# EAGLE design BQ25570 (EAGLE 7.1.0)
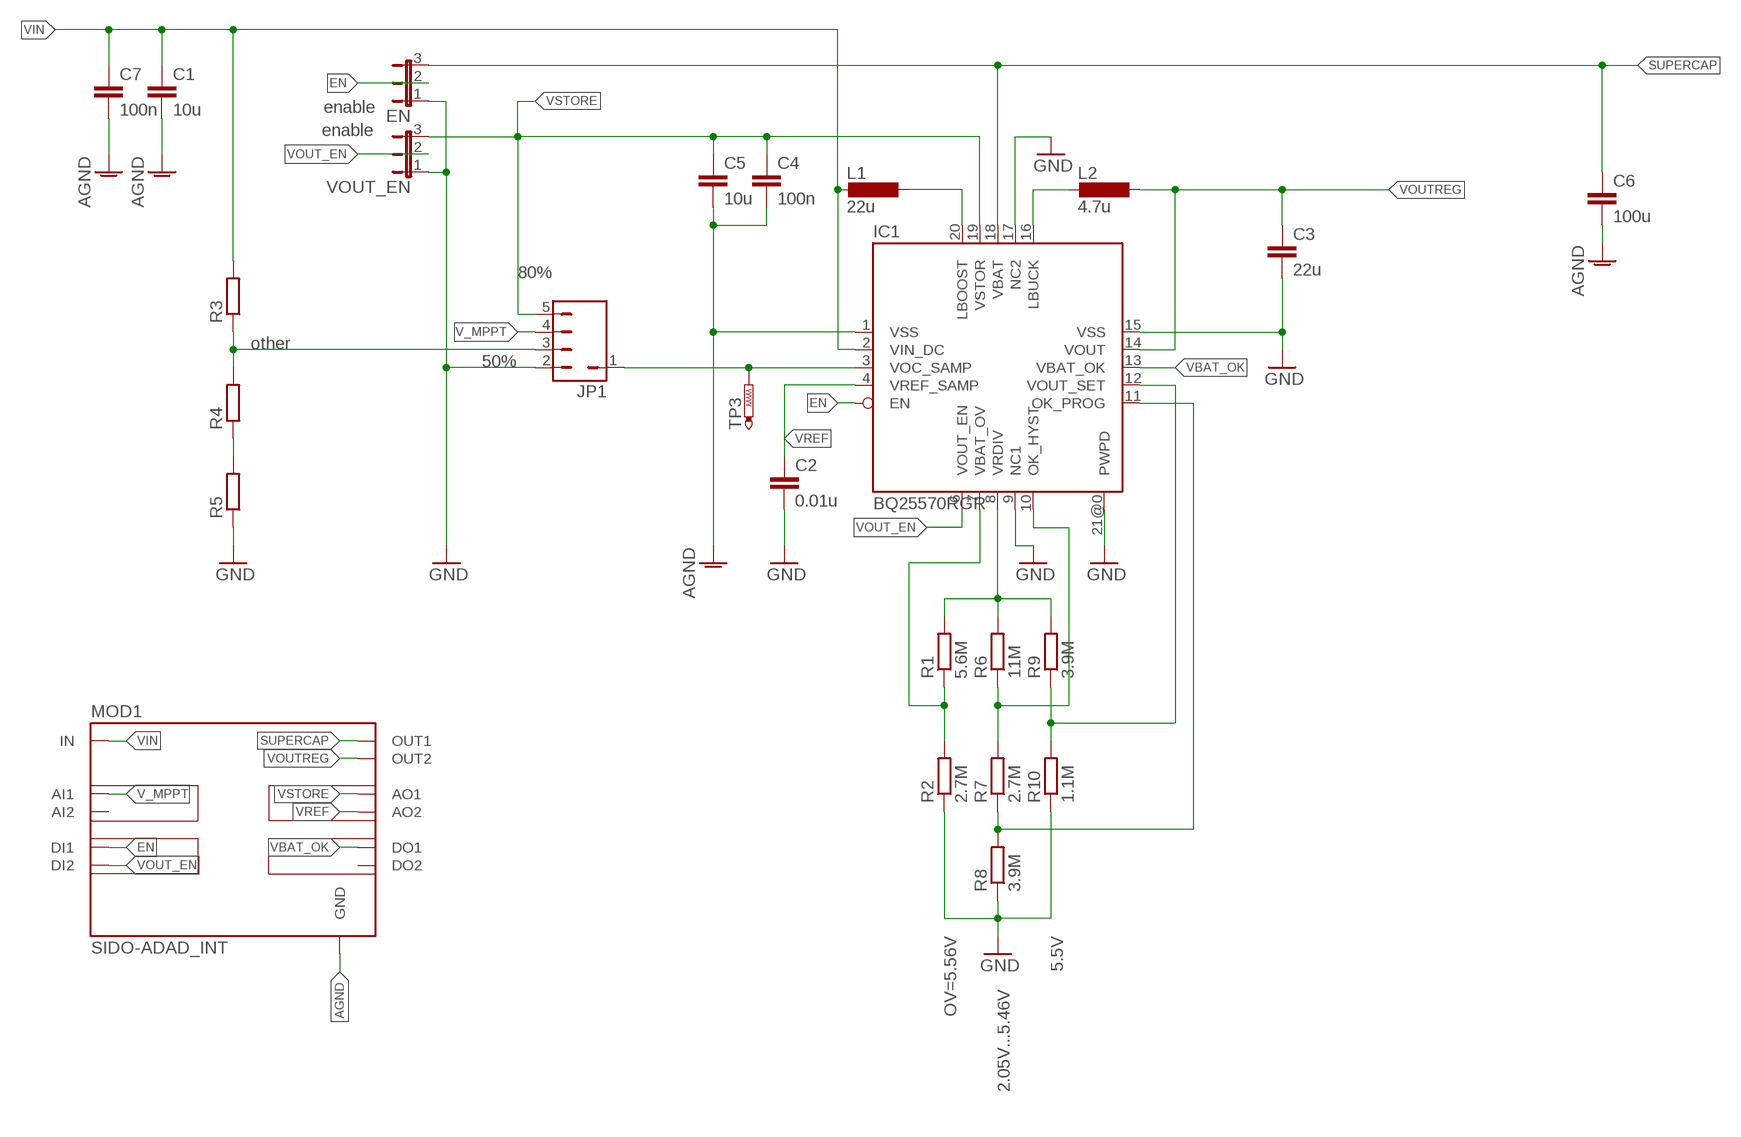
[diagram p0: schematic, sheet 1]

## Parts
C1  10u  C-EUC1206K  [C1206K]
C2  0.01u  C-EUC0805K  [C0805K]
C3  22u  C-EUC1206K  [C1206K]
C4  100n  C-EUC0805K  [C0805K]
C5  10u  C-EUC1206K  [C1206K]
C6  100u  C-EUC1206K  [C1206K]
C7  100n  C-EUC0805K  [C0805K]
EN  JP2E  [JP2]
IC1  BQ25570RGR  [QFN20]
JP1  JP3Q  [JP1-4]
L1  22u  L-EUL4035M  [L4035M]
L2  4.7u  L-EUL4035M  [L4035M]
MOD1  SIDO-ADAD_INT  [SIDO-ADAD]
R1  5.6M  R-EU_R0805  [R0805]
R2  2.7M  R-EU_R0805  [R0805]
R3  R-EU_R0805  [R0805]
R4  R-EU_R0805  [R0805]
R5  R-EU_R0805  [R0805]
R6  11M  R-EU_R0805  [R0805]
R7  2.7M  R-EU_R0805  [R0805]
R8  3.9M  R-EU_R0805  [R0805]
R9  3.9M  R-EU_R0805  [R0805]
R10  1.1M  R-EU_R0805  [R0805]
TP3  PTR1B1,27  [B1,27]
VOUT_EN  JP2E  [JP2]

## Nets
AGND: C1.2 C4.2 C5.2 C6.2 C7.2 IC1.1(VSS) MOD1.GND1(GND) MOD1.GND2(GND) MOD1.GND3(GND) MOD1.GND4(GND)
EN: EN.2 IC1.5(EN) MOD1.DI1
GND: C2.2 C3.2 EN.1 IC1.9(NC1) IC1.15(VSS) IC1.17(NC2) IC1.21@0(PWPD) JP1.2 R2.1 R5.1 R8.1 R10.1 VOUT_EN.1
N$3: JP1.3 R3.1 R4.2
N$5: IC1.7(VBAT_OV) R1.1 R2.2
N$6: IC1.3(VOC_SAMP) JP1.1 TP3.TP
N$7: IC1.16(LBUCK) L2.2
N$8: IC1.11(OK_PROG) R7.1 R8.2
N$10: IC1.10(OK_HYST) R6.1 R7.2
N$11: R4.1 R5.2
N$12: IC1.20(LBOOST) L1.1
N$13: IC1.12(VOUT_SET) R9.1 R10.2
SUPERCAP: C6.1 EN.3 IC1.18(VBAT) MOD1.OUT1_1(OUT1) MOD1.OUT1_2(OUT1) MOD1.OUT1_3(OUT1) MOD1.OUT1_4(OUT1)
V_MPPT: JP1.4 MOD1.AI1
VBAT_OK: IC1.13(VBAT_OK) MOD1.DO1
VIN: C1.1 C7.1 IC1.2(VIN_DC) L1.2 MOD1.IN1(IN) MOD1.IN2(IN) MOD1.IN3(IN) MOD1.IN4(IN) R3.2
VOUT_EN: IC1.6(VOUT_EN) MOD1.DI2 VOUT_EN.2
VOUTREG: C3.1 IC1.14(VOUT) L2.1 MOD1.OUT2_1(OUT2) MOD1.OUT2_2(OUT2) MOD1.OUT2_3(OUT2) MOD1.OUT2_4(OUT2)
VRDIV: IC1.8(VRDIV) R1.2 R6.2 R9.2
VREF: C2.1 IC1.4(VREF_SAMP) MOD1.AO2
VSTORE: C4.1 C5.1 IC1.19(VSTOR) JP1.5 MOD1.AO1 VOUT_EN.3
Unconnected: MOD1.AI2 MOD1.DO2

## Notes on the sheet
- enable
- enable
- 80%
- other
- 50%
- OV=5.56V | 5.5V
- 2.05V...5.46V

## Library data of the parts
C1-C7 = rcl:C-EU: CAPACITOR, European symbol
EN VOUT_EN = Jumper_mod:JP2E: JUMPER
IC1 = BQ25570:BQ25570: TEXAS INSTRUMENTS BQ25570 - VQFN20 http://www.ti.com/lit/ds/symlink/bq25570.pdf
JP1 = JP1-4:JP3Q: JUMPER
L1 L2 = resistor:L-EU: INDUCTOR, European symbol
MOD1 = AllModules:SIDO-ADAD_INT
R1-R10 = rcl:R-EU_: RESISTOR, European symbol
TP3 = testpad:PTR1: TEST PIN

## Board
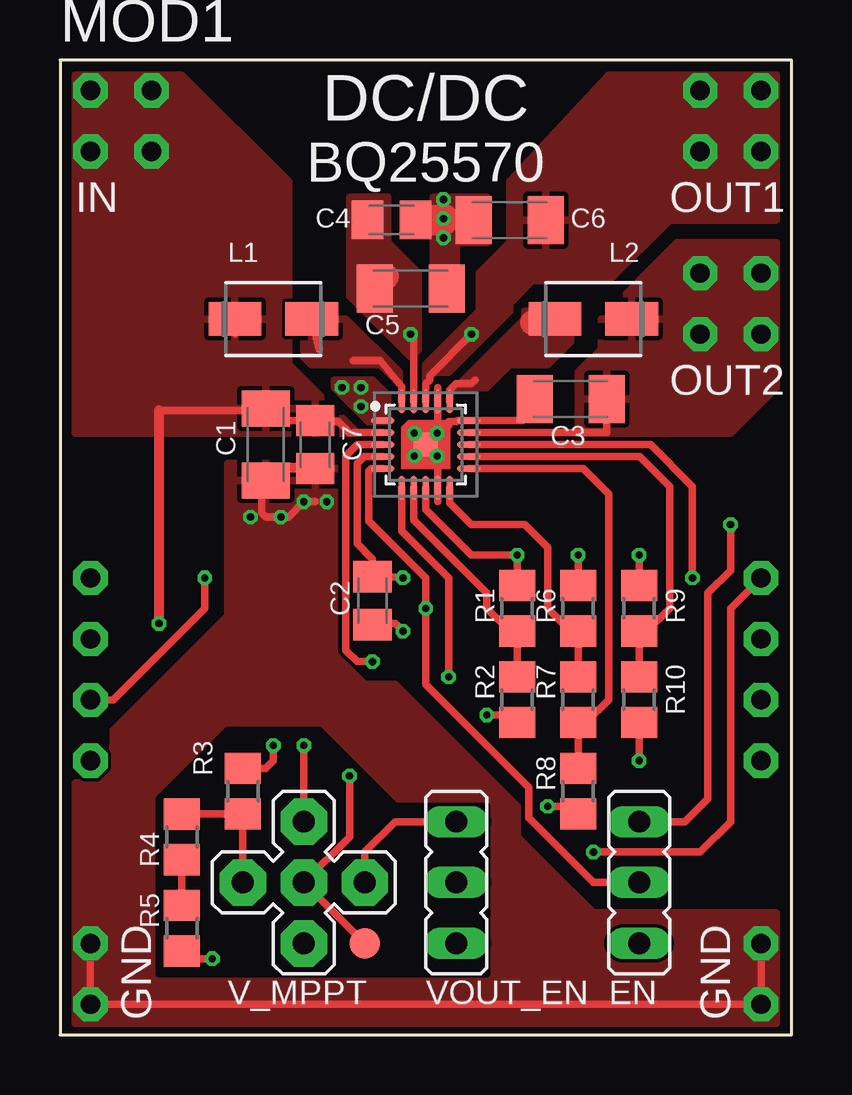
[diagram p1: board, top side]
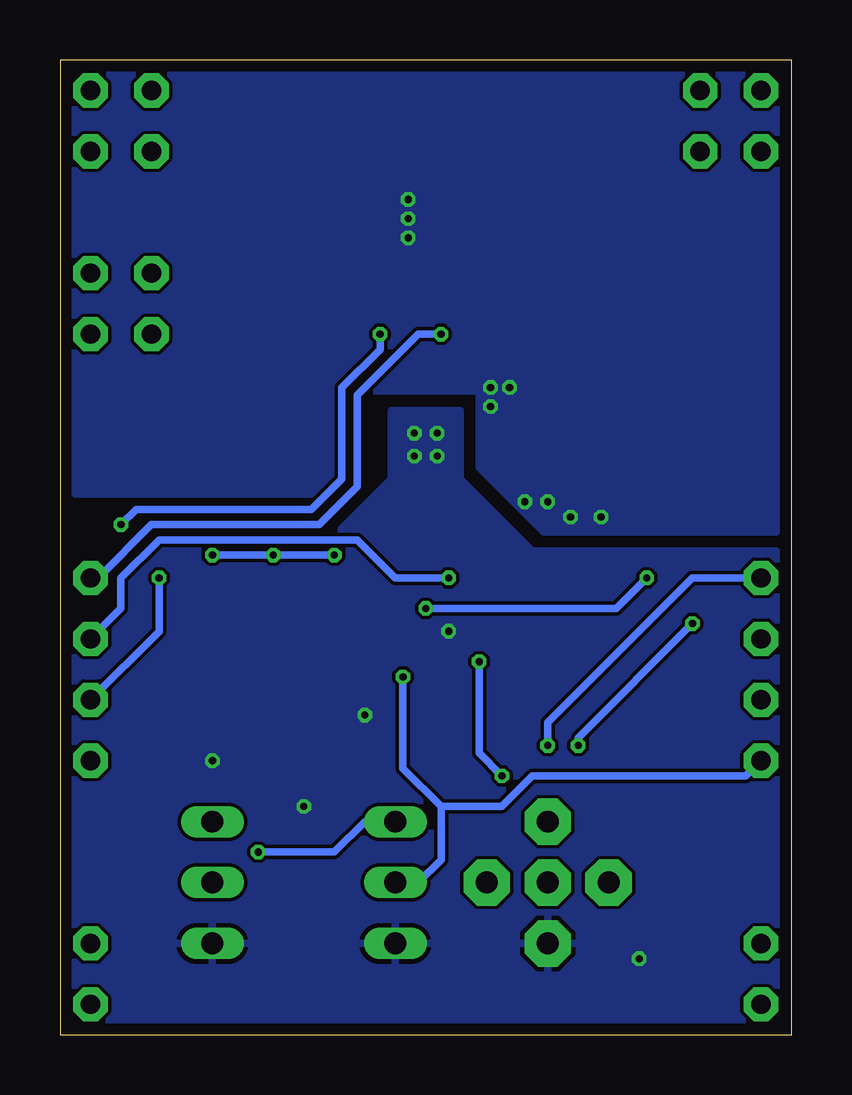
[diagram p2: board, bottom side, seen from below]

Size 30.48 x 40.64 mm. Coordinates in mm from the lower left corner, seen from the top.
Outline: 0,40.64 30.48,40.64 30.48,0 0,0 0,40.64
Copper layers (1*16): Top 0.035mm / dielectric 1.5mm / Bottom 0.035mm
Design rules "PCB-POOL Standard": minimum track width 0.15mm, minimum drill 0.3mm, track to track 0.15mm, track to pad 0.15mm, pad to pad 0.15mm, via to via 0.15mm, smd to smd 0.15mm, copper to edge 0.3mm, drill to drill 0.2mm, minimum pad ring 0.2mm, minimum via ring 0.15mm, stop-mask expansion 0.075mm, vias tented up to drill 0mil, thermal gap 0.2mm

### Footprints (pad centres in the part's own frame; a part is rotated, then mirrored left to right if it is on the bottom)
C1206K = smd 1.5 x 2: 1 -1.5,0; 2 1.5,0
C0805K = smd 1.3 x 1.6: 1 -1,0; 2 1,0
JP2 = drill 0.914 long: 1 -2.54,0; 2 0,0; 3 2.54,0
QFN20 = smd 0.28 x 1: 1 -1,-1.795; 2 -0.5,-1.795; 3 0,-1.795; 4 0.5,-1.795; 5 1,-1.795; 11 1,1.795; 12 0.5,1.795; 13 0,1.795; 14 -0.5,1.795; 15 -1,1.795 | smd 1 x 0.28: 6 1.795,-1; 7 1.795,-0.5; 8 1.795,0; 9 1.795,0.5; 10 1.795,1; 16 -1.795,1; 17 -1.795,0.5; 18 -1.795,0; 19 -1.795,-0.5; 20 -1.795,-1 | smd 1 x 1: 21@0 0,0
JP1-4 = drill 0.914 pad 1.93 octagon: 1 0,0; 2 0,2.54; 3 2.54,0; 4 0,-2.54; 5 -2.54,0
L4035M = smd 2.2 x 1.4: 1 -1.6,0; 2 1.6,0
SIDO-ADAD = drill 0.8 pad 1.422 octagon: AI1 0,-20.32; AI2 0,-22.86; AO1 27.94,-20.32; AO2 27.94,-22.86; DI1 0,-25.4; DI2 0,-27.94; DO1 27.94,-25.4; DO2 27.94,-27.94; GND1 0,-38.1; GND2 0,-35.56; GND3 27.94,-35.56; GND4 27.94,-38.1; IN1 0,0; IN2 0,-2.54; IN3 2.54,0; IN4 2.54,-2.54; OUT1_1 27.94,0; OUT1_2 27.94,-2.54; OUT1_3 25.4,0; OUT1_4 25.4,-2.54; OUT2_1 27.94,-7.62; OUT2_2 27.94,-10.16; OUT2_3 25.4,-7.62; OUT2_4 25.4,-10.16
R0805 = smd 1.3 x 1.5: 1 -0.95,0; 2 0.95,0
B1,27 = smd 1.27 x 1.27: TP 0,0

### Placement (x,y rotation side)
C1  8.57,24.61 270 top
C2  13.02,18.1 270 top
C3  21.27,26.51 180 top
C4  13.81,33.97 0 top
C5  14.61,31.12 0 top
C6  18.73,33.97 180 top
C7  10.64,24.61 270 top
EN  24.13,6.35 90 top
IC1  15.24,24.61 270 top
JP1  10.16,6.35 180 top
L1  8.89,29.84 180 top
L2  22.23,29.84 180 top
MOD1  1.27,39.37 0 top
R1  19.05,17.78 90 top
R2  19.05,13.97 90 top
R3  7.62,10.16 90 top
R4  5.08,8.26 90 top
R5  5.08,4.45 90 top
R6  21.59,17.78 90 top
R7  21.59,13.97 90 top
R8  21.59,10.16 90 top
R9  24.13,17.78 90 top
R10  24.13,13.97 90 top
TP3  12.7,3.81 0 top
VOUT_EN  16.51,6.35 90 top

### Tracks (layer width: path | path; a pad name or v marks a point on that pad's centre or on a via)
AGND  (via drill 0.3)
  Top 0.305: MOD1.GND3 MOD1.GND4 MOD1.GND1 MOD1.GND2 | C1.2 8.41,22.95 8.41,21.75 8.57,21.59 9.53,21.59 v10.16,22.23 10.64,22.23
  Top 0.406: 8.57,22.86 8.57,23.65 10.79,23.65
  Top 1.27: C4.2 15.97,33.97 v15.97,34.02
  other vias: 15.97,33.23 15.97,34.83 11.75,26.99 12.54,26.19 12.54,26.99 11.11,22.23 9.21,21.59 7.94,21.59
  pour Top: 0.64,0.48 0.64,10.48 2.22,12.07 2.22,12.7 6.99,17.46 6.99,23.81 11.43,23.81 11.43,15.88 12.7,14.61 13.97,14.61 19.05,9.53 19.05,8.26 22.23,5.08 29.84,5.08 29.84,0.48
  pour Top (no thermals): 0.64,4.76 2.22,4.76 2.22,0.48 0.64,0.48
  pour Top (no thermals): 27.94,5.08 29.84,5.08 29.84,0.48 28.1,0.48
  cutout Top (no thermals): 4.13,9.84 4.13,2.54 17.78,2.54 17.78,9.53 13.97,9.53 10.79,12.7 6.99,12.7
  pour Bottom: 0.64,40.01 0.64,20.96 10.32,20.96 13.02,23.65 13.02,26.83 18.73,26.83 18.73,23.18 19.37,22.54 29.84,22.54 29.84,40.01
  pour Top (no thermals): 15.56,30.8 15.56,34.92 17.78,34.92 17.78,33.02 16.51,33.02 16.51,30.8
  pour Top (no thermals): 11.43,26.99 11.43,27.3 13.02,27.3 13.65,26.67 13.65,25.4 13.02,25.4
EN  (via drill 0.3)
  Top 0.305: IC1.5 12.97,23.61 12.86,23.5 12.86,21.43 15.24,19.05 v15.24,17.78 15.24,14.61 19.53,10.32 19.53,9.05 22.23,6.35 EN.2 | v6.03,19.05 6.03,17.78 2.22,13.97 MOD1.DI1
  Bottom 0.305: v6.03,19.05 7.3,17.78 v15.24,17.78
GND  (via drill 0.3)
  Top 0: IC1.21@0 15.72,24.61 v15.72,25.08
  Top 0.305: C3.2 19.37,26.11 19.37,25.72 19.26,25.61 IC1.15 16.56,25.61 16.51,25.56 16.19,25.56 | 18.89,12.54 R2.1 18.73,13.34 v17.78,13.34 | 16.19,25.56 v15.72,25.08 | 15.74,25.4 IC1.9 15.74,22.23 | 15.74,25.4 IC1.17 15.74,26.99 | v24.13,11.43 R10.1 | v20.32,9.53 21.27,9.53 R8.1 | v6.35,3.17 5.4,3.17 R5.1 | v14.29,16.83 13.97,17.14 13.06,17.14 C2.2 | 16.19,25.56 16.19,25.4 15.74,25.4
  Top 0.406: 19.05,12.7 R2.1
  other vias: 14.76,25.08 14.76,24.13 15.72,24.13
  pour Bottom: 0.64,20.16 0.64,0.63 29.84,0.63 29.84,20.16
  pour Bottom (no thermals): 13.81,23.18 13.81,26.04 16.67,26.04 16.67,23.18 19.68,20.16 10.79,20.16
N$3
  Top 0.305: R4.2 R3.1 JP1.3
N$5
  Top 0.305: R2.2 R1.1 18.73,16.83 17.78,17.78 17.78,18.41 14.74,21.46 IC1.7
N$6  (via drill 0.3)
  Top 0.305: TP3.TP JP1.1 12.06,8.26 v12.06,10.8 | v13.02,15.56 12.38,15.56 11.91,16.03 11.91,24.13 12.38,24.61 IC1.3
  Bottom 0.305: v12.06,10.8 13.02,11.75 v13.02,15.56
N$7
  Top 0.305: IC1.16 16.24,26.88 16.51,27.15 17.14,27.15 17.3,27.3
  Top 1.016: 19.68,29.69 L2.2
  pour Top (no thermals): 16.51,26.99 19.37,29.84 19.37,30.16 21.27,30.16 21.27,28.89 20.32,27.94 18.73,27.94 17.78,26.99
N$8
  Top 0.305: IC1.11 21.8,23.61 22.86,22.54 22.86,13.97 21.91,13.02 R7.1 R8.2
N$10
  Top 0.305: R7.2 R6.1 21.27,16.83 20.32,17.78 20.32,20.32 19.37,21.27 17.14,21.27 16.24,22.18 IC1.10
N$11
  Top 0.305: R5.2 R4.1
N$12
  Top 0.305: IC1.20 14.24,27.04 14.13,27.15 13.34,28.1 12.22,28.1 | 10.79,28.58 L1.1
  pour Top: 13.34,27.94 10.48,27.94 10.16,28.26 10.16,29.84 11.91,29.84 14.13,27.62 14.13,27.15
N$13
  Top 0.305: R10.2 R9.1 24.45,16.83 25.4,17.78 25.4,22.86 24.15,24.11 IC1.12
SUPERCAP  (via drill 0.3)
  Top 0.305: IC1.18 15.24,27.15 15.4,27.3 15.4,27.46 v17.14,29.21 | EN.3 26.04,8.89 26.99,9.84 26.99,18.41 27.94,19.37 v27.94,21.27
  Bottom 0.305: v27.94,21.27 27.3,21.91 20,21.91 18.73,23.18 18.73,26.99 17.14,28.58 v17.14,29.21
  pour Top: 15.24,27.3 15.24,27.94 17.46,30.16 17.46,31.75 18.73,33.02 18.73,35.56 22.86,40.01 29.84,40.01 29.84,33.97 25.4,33.97 22.86,31.43 19.68,31.43 18.73,30.48 18.73,30.16 16.19,27.62 15.56,27.62
  pour Top (no thermals): 29.84,40.01 25.72,40.01 25.72,35.88 29.84,35.88
V_MPPT  (via drill 0.3)
  Top 0.305: v10.16,12.07 JP1.4
  Bottom 0.305: MOD1.AI1 4.13,19.05 10.16,13.02 v10.16,12.07
VBAT_OK  (via drill 0.3)
  Top 0.305: IC1.13 24.61,24.61 26.35,22.86 v26.35,19.05
  Bottom 0.305: v26.35,19.05 26.35,16.83 MOD1.DO1
VIN  (via drill 0.3)
  Top 0.305: 10.64,25.11 C7.1 | C7.1 9.07,25.61 C1.1 8.26,26.04 4.13,26.04 | 7.3,29.21 L1.2 | IC1.2 12.25,25.11 12.22,25.08 12.06,25.08 11.59,25.56 10.68,25.56 C7.1 | R3.2 8.57,11.11 8.89,11.43 v8.89,12.07
  Top 0.406: v4.13,17.14 4.13,26.04
  Bottom 0.305: v4.13,17.14 8.89,12.38 v8.89,12.07
  pour Top: 0.64,40.01 0.64,25.08 12.38,25.08 9.53,27.94 9.53,35.56 5.08,40.01
  pour Top (no thermals): 0.64,40.01 0.64,35.72 4.92,35.72 4.92,40.01
VOUT_EN  (via drill 0.3)
  Top 0.305: IC1.6 14.24,21 16.19,19.05 v16.19,14.92
  Bottom 0.305: v16.19,14.92 16.19,11.11 14.61,9.53 | MOD1.DI2 1.91,10.8 10.79,10.8 12.06,9.53 14.61,9.53 | VOUT_EN.2 15.56,6.35 14.61,7.3 14.61,9.53
VOUTREG
  Top 0.305: IC1.14 22.77,25.11 C3.1
  pour Top (no thermals): 29.84,33.02 25.72,33.02 25.72,28.26 29.84,28.26
  pour Top: 21.59,25.08 21.59,27.62 22.54,28.58 22.54,29.84 25.72,33.02 29.84,33.02 29.84,26.99 27.94,25.08
VRDIV  (via drill 0.3)
  Top 0.305: 21.59,18.57 R6.2 v21.59,20 | R1.2 v19.05,20 17.14,20 15.24,21.91 IC1.8 | R9.2 v24.13,20
  Bottom 0.305: v19.05,20 v21.59,20 v24.13,20
VREF  (via drill 0.3)
  Top 0.305: IC1.4 12.68,24.11 12.38,23.81 12.38,20.48 13.02,19.84 C2.1 | 13.29,19.1 C2.1 | v14.29,19.05 13.92,19.1 C2.1
  Bottom 0.305: MOD1.AO2 27.94,17.78 27.94,19.05 26.35,20.64 18.1,20.64 16.51,19.05 v14.29,19.05
VSTORE  (via drill 0.3)
  Top 0.305: IC1.19 14.74,29.21 | 14.74,29.21 14.74,29.23 | v14.61,29.21 14.74,29.21 | MOD1.AO1 27.94,17.78 27.94,8.89 26.67,7.62 v22.23,7.62 | VOUT_EN.3 13.97,8.89 12.7,7.62 JP1.5
  Top 1.016: 13.61,31.62 C5.1
  Bottom 0.305: v14.61,29.21 15.56,29.21 18.1,26.67 18.1,22.86 19.68,21.27 26.67,21.27 28.89,19.05 MOD1.AO1 | v22.23,7.62 19.05,7.62 17.78,8.89 VOUT_EN.3
  pour Top (no thermals): 14.61,28.26 12.06,30.8 12.06,34.92 13.65,34.92 13.65,33.02 14.92,31.75 14.92,28.58

### Text on the board
tNames: DC/DC | BQ25570 | V_MPPT
bStop: Beckedahl & Kokert 12.03.2015